# Altium schematic sheet SNES_DRONE_CART.SchDoc
size A4
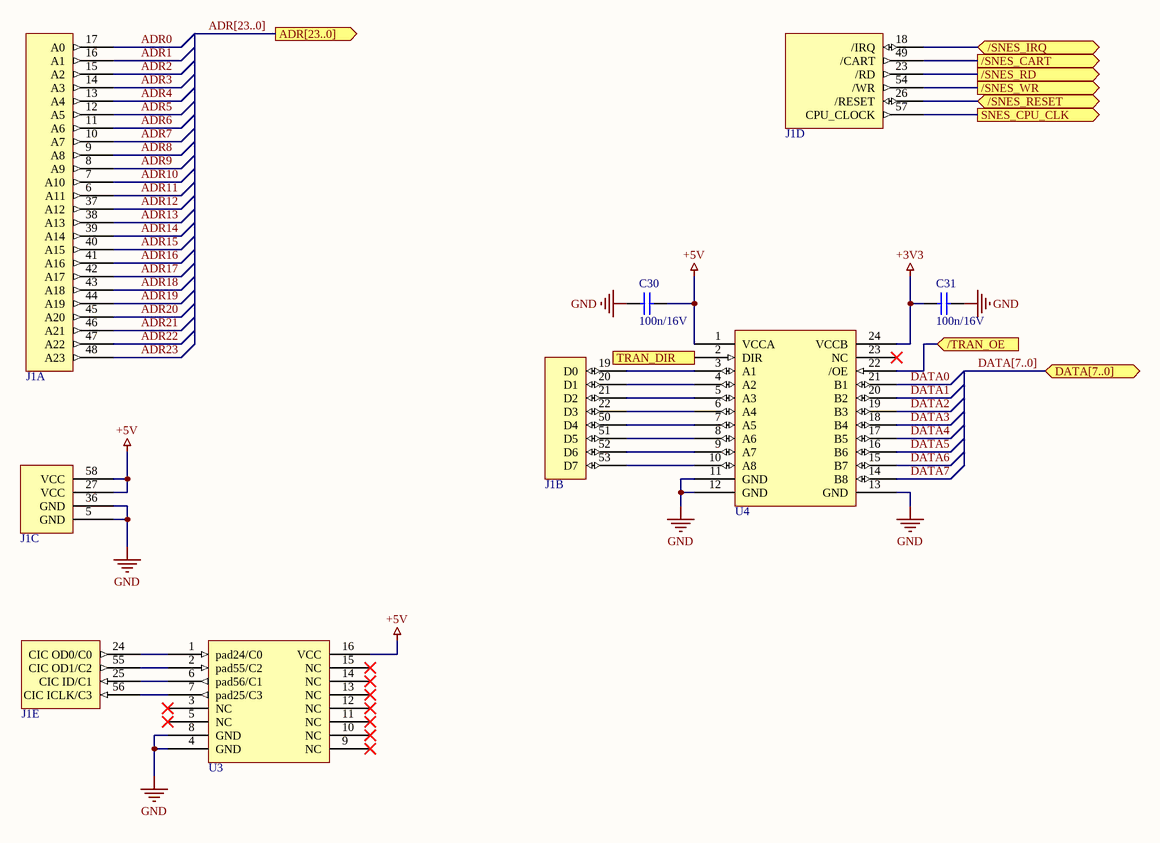
[diagram p0: SNES_DRONE_CART.SchDoc]

## Parts
C30  100n/16V  [0402_RES]
C31  100n/16V  [0402_RES]
J1  SNES Cartridge Connector  [SNES Cartridge Connector]  (value not drawn)  (parts A,B,C,D,E of 5)  (net tie, no BOM)
U3  IC_D411A  [DIP16]  (value not drawn)  (net tie, no BOM)
U4  IC_SN74LVCC3245APWR  [TSSOP24]  (value not drawn)

## Ports
/SNES_CART (out), /SNES_IRQ (bidir), /SNES_RD (out), /SNES_RESET (bidir), /SNES_WR (out), /TRAN_OE (in), ADR[23..0] (out), DATA[7..0] (bidir), SNES_CPU_CLK (out), TRAN_DIR (in)

## Nets
+3V3: C31.1 U4.24(VCCB)
+5V: C30.2 J1.27(VCC) J1.58(VCC) U3.16(VCC) U4.1(VCCA)
GND: C30.1 C31.2 J1.5(GND) J1.36(GND) U3.4(GND) U3.8(GND) U4.11(GND) U4.12(GND) U4.13(GND)
/SNES_CART: J1.49(/CART) ; port /SNES_CART
/SNES_IRQ: J1.18(/IRQ) ; port /SNES_IRQ
/SNES_RD: J1.23(/RD) ; port /SNES_RD
/SNES_RESET: J1.26(/RESET) ; port /SNES_RESET
/SNES_WR: J1.54(/WR) ; port /SNES_WR
/TRAN_OE: U4.22(/OE) ; port /TRAN_OE
ADR0: J1.17(A0)
ADR1: J1.16(A1)
ADR2: J1.15(A2)
ADR3: J1.14(A3)
ADR4: J1.13(A4)
ADR5: J1.12(A5)
ADR6: J1.11(A6)
ADR7: J1.10(A7)
ADR8: J1.9(A8)
ADR9: J1.8(A9)
ADR10: J1.7(A10)
ADR11: J1.6(A11)
ADR12: J1.37(A12)
ADR13: J1.38(A13)
ADR14: J1.39(A14)
ADR15: J1.40(A15)
ADR16: J1.41(A16)
ADR17: J1.42(A17)
ADR18: J1.43(A18)
ADR19: J1.44(A19)
ADR20: J1.45(A20)
ADR21: J1.46(A21)
ADR22: J1.47(A22)
ADR23: J1.48(A23)
DATA0: U4.21(B1)
DATA1: U4.20(B2)
DATA2: U4.19(B3)
DATA3: U4.18(B4)
DATA4: U4.17(B5)
DATA5: U4.16(B6)
DATA6: U4.15(B7)
DATA7: U4.14(B8)
SNES_CPU_CLK: J1.57(CPU_CLOCK) ; port SNES_CPU_CLK
TRAN_DIR: U4.2(DIR) ; port TRAN_DIR
NetJ1_19: J1.19(D0) U4.3(A1)
NetJ1_20: J1.20(D1) U4.4(A2)
NetJ1_21: J1.21(D2) U4.5(A3)
NetJ1_22: J1.22(D3) U4.6(A4)
NetJ1_24: J1.24(CIC_OD0/C0) U3.1(pad24/C0)
NetJ1_25: J1.25(CIC_ID/C1) U3.6(pad56/C1)
NetJ1_50: J1.50(D4) U4.7(A5)
NetJ1_51: J1.51(D5) U4.8(A6)
NetJ1_52: J1.52(D6) U4.9(A7)
NetJ1_53: J1.53(D7) U4.10(A8)
NetJ1_55: J1.55(CIC_OD1/C2) U3.2(pad55/C2)
NetJ1_56: J1.56(CIC_ICLK/C3) U3.7(pad25/C3)

Not connected (* = marked no-connect by the designer): U3 3(NC)* 5(NC)* 9(NC)* 10(NC)* 11(NC)* 12(NC)* 13(NC)* 14(NC)* 15(NC)*; U4 23(NC)*

## Buses and harness runs
bus ADR[23..0] = port ADR[23..0]
bus DATA[7..0] = port DATA[7..0]

## Library data of the parts
C30 C31 = Cap_100n_0402: Keramikvielschichtkondensator, SMD, 0.1 µF, 16 V, 0402 [Metrisch 1005], ± 10%, X5R, Baureihe MC; Manufacturer Part Number 1: MC0402X104K160CT; Manufacturer 1: MULTICOMP; farnell number: 1759388; datasheet: http://www.farnell.com/datasheets/2046096.pdf?_ga=2.184862249.1080119096.1514547302-1693477411.1514385574; Supplier Unit Price 1: 0,0226; Supplier Order Qty 1: 10; ComponentLink1Description: datasheet; ComponentLink1URL: http://www.farnell.com/datasheets/1901289.pdf?_ga=2.126104776.453785206.1540794792-1293375253.1539206166; ComponentLink2Description: farnell; ComponentLink2URL: https://at.farnell.com/multicomp/mc0402x104k160ct/kondensator-0-1-f-16v-10-x5r-0402/dp/1759388?st=1%C2%B5F%20SMD; Supplier 1: Farnell; Supplier Part Number 1: 1760121; Value: 100n/16V
U3 = IC_D411A: SNES CIC Chip; ComponentLink1Description: info; ComponentLink1URL: https://wiki.superfamicom.org/cic
U4 = IC_SN74LVCC3245APWR: Bus-Transceiver, Produktreihe LVC, 8 Eingänge, 50mA, 7ns, 2.3V bis 5.5V, TSSOP 24; Manufacturer 1: TEXAS INSTRUMENTS; ComponentLink3Description: datsheet; ComponentLink3URL: http://www.ti.com/lit/ds/symlink/sn74lvcc3245a.pdf; ComponentLink4Description: farnell; ComponentLink4URL: https://at.farnell.com/texas-instruments/sn74lvcc3245apwr/bus-transceiver-8bit-tssop-24/dp/2854646?rpsku=rel3%3A2119962&st=2119962; Supplier 1: Farnell; Supplier Part Number 1: 2854646; Manufacturer Part Number 1: SN74LVCC3245APWR; Supplier Unit Price 1: 0,99; Supplier Order Qty 1: 1